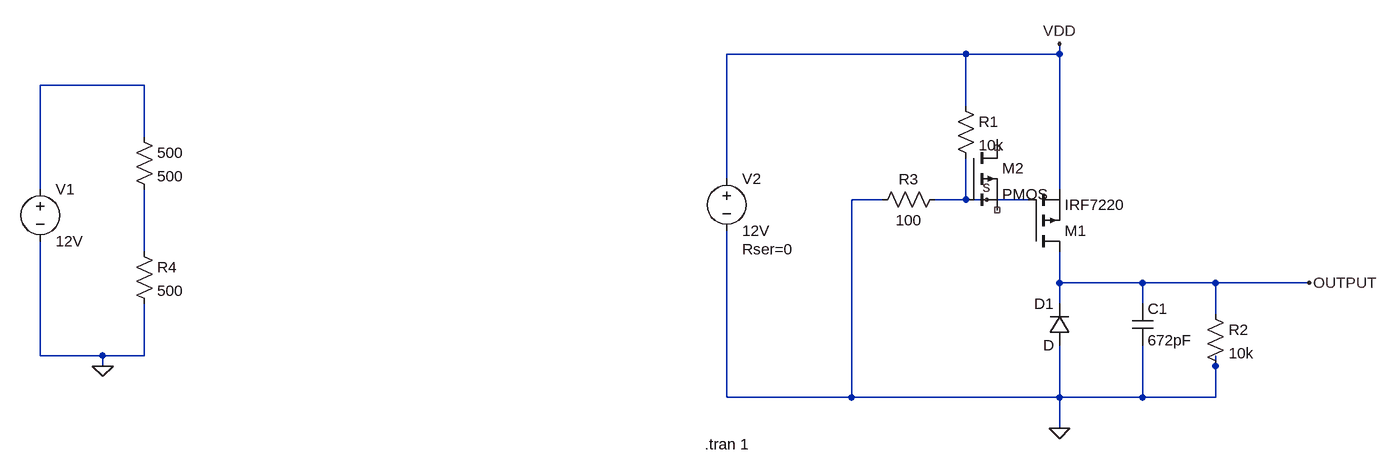
[diagram p0: schematic Draft1.asc]
Draft1.asc, the LTspice schematic file:
Version 4
SHEET 1 880 680
WIRE 32 -96 -336 -96
WIRE 176 -96 176 -112
WIRE 176 -96 32 -96
WIRE -1232 -48 -1392 -48
WIRE 32 -16 32 -96
WIRE -1232 32 -1232 -48
WIRE -336 96 -336 -96
WIRE -1392 112 -1392 -48
WIRE 176 112 176 -96
WIRE -96 128 -144 128
WIRE 32 128 32 64
WIRE 32 128 -16 128
WIRE 64 128 32 128
WIRE 128 128 64 128
WIRE -1232 208 -1232 112
WIRE 176 256 176 208
WIRE 304 256 176 256
WIRE 416 256 304 256
WIRE 560 256 416 256
WIRE 176 288 176 256
WIRE 304 288 304 256
WIRE 416 304 416 256
WIRE -1392 368 -1392 192
WIRE -1296 368 -1392 368
WIRE -1232 368 -1232 288
WIRE -1232 368 -1296 368
WIRE -1296 384 -1296 368
WIRE 416 384 416 368
WIRE -336 432 -336 176
WIRE -144 432 -144 128
WIRE -144 432 -336 432
WIRE 176 432 176 352
WIRE 176 432 -144 432
WIRE 304 432 304 352
WIRE 304 432 176 432
WIRE 416 432 416 384
WIRE 416 432 304 432
WIRE 176 480 176 432
FLAG 176 480 0
FLAG -1296 384 0
FLAG 64 128 s
FLAG 560 256 OUTPUT
FLAG 176 -112 VDD
SYMBOL res 16 -32 R0
SYMATTR InstName R1
SYMATTR Value 10k
SYMBOL voltage -336 80 R0
WINDOW 123 0 0 Left 0
WINDOW 39 24 124 Left 2
SYMATTR InstName V2
SYMATTR Value 12V
SYMATTR SpiceLine Rser=0
SYMBOL res 0 112 R90
WINDOW 0 0 56 VBottom 2
WINDOW 3 32 56 VTop 2
SYMATTR InstName R3
SYMATTR Value 100
SYMBOL voltage -1392 96 R0
WINDOW 123 0 0 Left 0
WINDOW 39 0 0 Left 0
SYMATTR InstName V1
SYMATTR Value 12V
SYMBOL res -1248 16 R0
SYMATTR InstName 500
SYMATTR Value 500
SYMBOL res -1248 192 R0
SYMATTR InstName R4
SYMATTR Value 500
SYMBOL pmos 128 208 M180
SYMATTR InstName M1
SYMATTR Value IRF7220
SYMBOL diode 192 352 R180
WINDOW 0 24 64 Left 2
WINDOW 3 24 0 Left 2
SYMATTR InstName D1
SYMBOL cap 288 288 R0
SYMATTR InstName C1
SYMATTR Value 672pF
SYMBOL res 400 288 R0
SYMATTR InstName R2
SYMATTR Value 10k
SYMBOL pmos 32 48 R0
SYMATTR InstName M2
TEXT -370 504 Left 2 !.tran 1

The netlist it stands for:
* Draft1.asc
R1 VDD s 10k
V2 VDD 0 12V Rser=0
R3 s 0 100
V1 N001 0 12V
R§500 N001 N002 500
R4 N002 0 500
M1 OUTPUT s VDD VDD IRF7220
D1 0 OUTPUT D
C1 OUTPUT 0 672pF
R2 OUTPUT 0 10k
M2 NC_01 s NC_02 NC_02 PMOS
.model D D
.lib standard.dio
.model NMOS NMOS
.model PMOS PMOS
.lib standard.mos
.tran 1
.backanno
.end